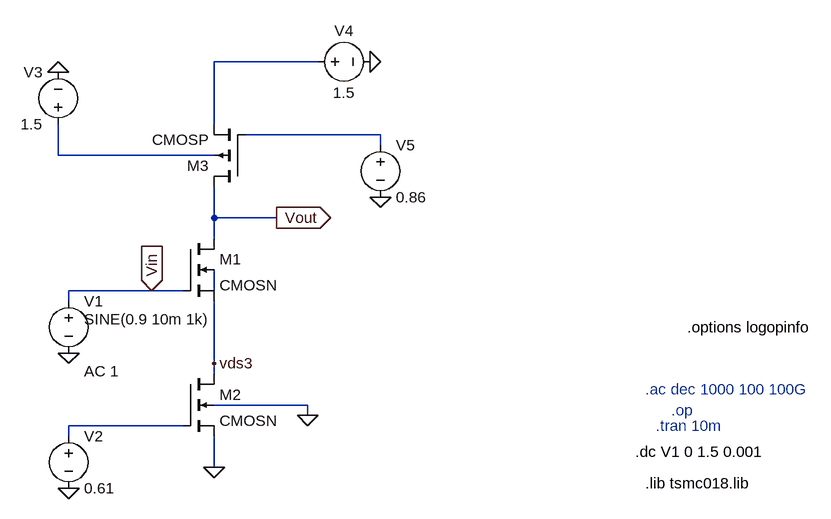
[diagram p0: schematic exp-02-b.asc]
exp-02-b.asc, the LTspice schematic file:
Version 4.1
SHEET 1 1384 680
WIRE 384 -128 224 -128
WIRE 224 -32 224 -128
WIRE 480 -16 272 -16
WIRE 480 0 480 -16
WIRE -16 16 -16 -32
WIRE 224 16 -16 16
WIRE 224 112 224 64
WIRE 320 112 224 112
WIRE 224 144 224 112
WIRE 128 224 0 224
WIRE 176 224 128 224
WIRE 224 224 224 192
WIRE 0 240 0 224
WIRE 224 336 224 240
WIRE 224 352 224 336
WIRE 368 400 224 400
WIRE 368 416 368 400
WIRE 176 432 0 432
WIRE 0 448 0 432
WIRE 224 496 224 448
FLAG 224 496 0
FLAG 368 416 0
FLAG -16 -112 0
FLAG 464 -128 0
FLAG 480 80 0
FLAG 0 528 0
FLAG 0 320 0
FLAG 320 112 Vout
IOPIN 320 112 Out
FLAG 128 224 Vin
IOPIN 128 224 In
FLAG 224 336 vds3
SYMBOL nmos4 176 144 R0
SYMATTR InstName M1
SYMATTR Value CMOSN
SYMATTR Value2 l=180n w=17.59u
SYMBOL nmos4 176 352 R0
SYMATTR InstName M2
SYMATTR Value CMOSN
SYMATTR Value2 l=180n w=24.4u
SYMBOL pmos4 272 64 R180
SYMATTR InstName M3
SYMATTR Value CMOSP
SYMATTR Value2 l=180n w=57.97u
SYMBOL voltage 0 224 R0
WINDOW 123 24 124 Left 2
WINDOW 39 0 0 Left 0
WINDOW 3 24 44 Left 2
SYMATTR Value2 AC 1
SYMATTR Value SINE(0.9 10m 1k)
SYMATTR InstName V1
SYMBOL voltage 0 432 R0
WINDOW 123 0 0 Left 0
WINDOW 39 0 0 Left 0
SYMATTR InstName V2
SYMATTR Value 0.61
SYMBOL voltage -16 -16 R180
WINDOW 0 24 96 Left 2
WINDOW 3 24 16 Left 2
WINDOW 123 0 0 Left 0
WINDOW 39 0 0 Left 0
SYMATTR InstName V3
SYMATTR Value 1.5
SYMBOL voltage 368 -128 R270
WINDOW 0 32 56 VTop 2
WINDOW 3 -32 56 VBottom 2
WINDOW 123 0 0 Left 0
WINDOW 39 0 0 Left 0
SYMATTR InstName V4
SYMATTR Value 1.5
SYMBOL voltage 480 -16 R0
WINDOW 123 0 0 Left 0
WINDOW 39 0 0 Left 0
SYMATTR InstName V5
SYMATTR Value 0.86
TEXT 888 520 Left 2 !.lib tsmc018.lib
TEXT 928 408 Left 2 ;.op
TEXT 872 472 Left 2 !.dc V1 0 1.5 0.001
TEXT 904 432 Left 2 ;.tran 10m
TEXT 888 376 Left 2 ;.ac dec 1000 100 100G
TEXT 952 280 Left 2 !.options logopinfo

The netlist it stands for:
* exp-02-b.asc
M1 Vout Vin vds3 N004 CMOSN l=180n w=17.59u
M2 vds3 N005 0 0 CMOSN l=180n w=24.4u
M3 Vout N002 N001 N003 CMOSP l=180n w=57.97u
V1 Vin 0 SINE(0.9 10m 1k) AC 1
V2 N005 0 0.61
V3 N003 0 1.5
V4 N001 0 1.5
V5 N002 0 0.86
.model NMOS NMOS
.model PMOS PMOS
.lib standard.mos
.lib tsmc018.lib
* .op
.dc V1 0 1.5 0.001
* .tran 10m
* .ac dec 1000 100 100G
.options logopinfo
.backanno
.end